# Altium schematic sheet baseboard.SchDoc
size A4
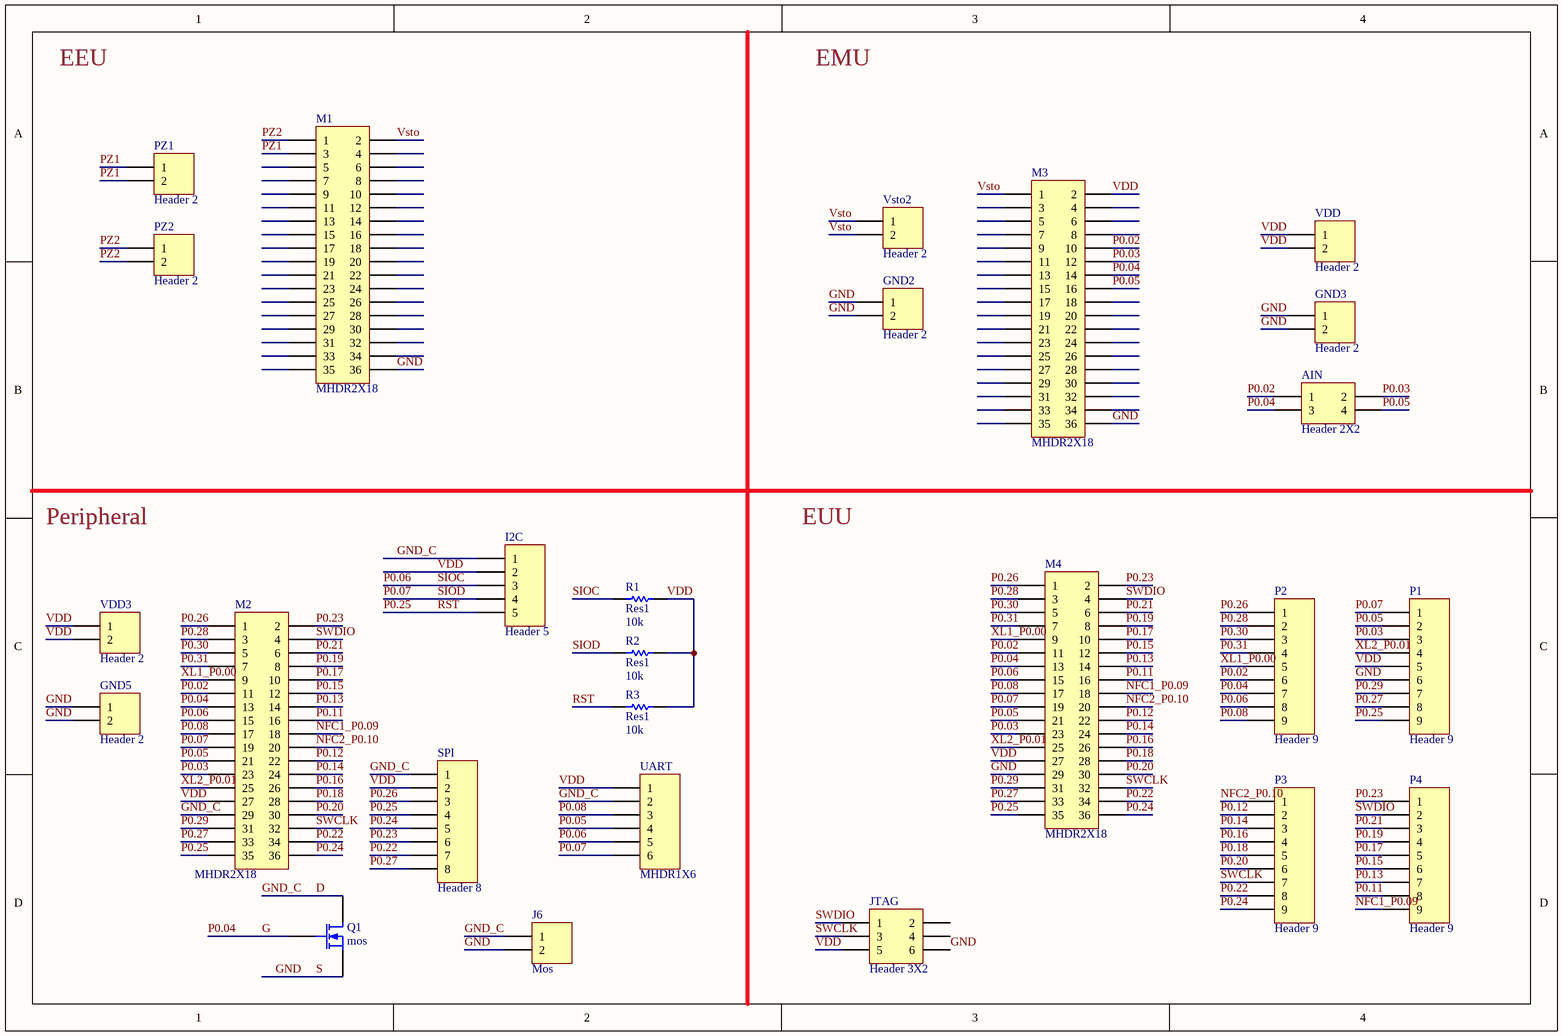
[diagram p0: baseboard.SchDoc]

## Parts
AIN  Header 2X2  [HDR2X2]
GND2  Header 2  [HDR1X2]
GND3  Header 2  [HDR1X2]
GND5  Header 2  [HDR1X2]
I2C  Header 5  [HDR1X5]
J6  Mos  [HDR1X2]
JTAG  Header 3X2  [HDR2X3]
M1  MHDR2X18  [module9x4]
M2  MHDR2X18  [module9x4]
M3  MHDR2X18  [module9x4]
M4  MHDR2X18  [module9x4]
P1  Header 9  [HDR1X9]
P2  Header 9  [HDR1X9]
P3  Header 9  [HDR1X9]
P4  Header 9  [HDR1X9]
PZ1  Header 2  [HDR1X2]
PZ2  Header 2  [HDR1X2]
Q1  mos  [SOT23_N]
R1  Res1  value 10k  [res]
R2  Res1  value 10k  [res]
R3  Res1  value 10k  [res]
SPI  Header 8  [HDR1X8]
UART  MHDR1X6  [HDR1X6]
VDD  Header 2  [HDR1X2]
VDD3  Header 2  [HDR1X2]
Vsto2  Header 2  [HDR1X2]

## Nets
D: I2C.1 J6.1 M2.29 Q1.1(D) SPI.1 UART.2  [also labelled GND_C]
G: AIN.3 M2.13 M3.14 M4.13 P2.7 Q1.3(G)  [also labelled P0.04]
GND: GND2.1 GND2.2 GND3.1 GND3.2 GND5.1 GND5.2 J6.2 JTAG.6 M1.36 M3.36 M4.29 P1.6 Q1.2(S)  [also labelled S]
NFC1_P0.09: M2.18 M4.18 P4.9
NFC2_P0.10: M2.20 M4.20 P3.1
P0.02: AIN.1 M2.11 M3.10 M4.11 P2.6
P0.03: AIN.2 M2.23 M3.12 M4.23 P1.3
P0.05: AIN.4 M2.21 M3.16 M4.21 P1.2 UART.4
P0.06: I2C.3 M2.15 M4.15 P2.8 R1.1 UART.5  [also labelled SIOC]
P0.07: I2C.4 M2.19 M4.19 P1.1 R2.1 UART.6  [also labelled SIOD]
P0.08: M2.17 M4.17 P2.9 UART.3
P0.11: M2.16 M4.16 P4.8
P0.12: M2.22 M4.22 P3.2
P0.13: M2.14 M4.14 P4.7
P0.14: M2.24 M4.24 P3.3
P0.15: M2.12 M4.12 P4.6
P0.16: M2.26 M4.26 P3.4
P0.17: M2.10 M4.10 P4.5
P0.18: M2.28 M4.28 P3.5
P0.19: M2.8 M4.8 P4.4
P0.20: M2.30 M4.30 P3.6
P0.21: M2.6 M4.6 P4.3
P0.22: M2.34 M4.34 P3.8 SPI.7
P0.23: M2.2 M4.2 P4.1 SPI.6
P0.24: M2.36 M4.36 P3.9 SPI.5
P0.25: I2C.5 M2.35 M4.35 P1.9 R3.1 SPI.4  [also labelled RST]
P0.26: M2.1 M4.1 P2.1 SPI.3
P0.27: M2.33 M4.33 P1.8 SPI.8
P0.28: M2.3 M4.3 P2.2
P0.29: M2.31 M4.31 P1.7
P0.30: M2.5 M4.5 P2.3
P0.31: M2.7 M4.7 P2.4
PZ1: M1.3 PZ1.1 PZ1.2
PZ2: M1.1 PZ2.1 PZ2.2
SWCLK: JTAG.3 M2.32 M4.32 P3.7
SWDIO: JTAG.1 M2.4 M4.4 P4.2
VDD: I2C.2 JTAG.5 M2.27 M3.2 M4.27 P1.5 R1.2 R2.2 R3.2 SPI.2 UART.1 VDD.1 VDD.2 VDD3.1 VDD3.2
Vsto: M1.2 M3.1 Vsto2.1 Vsto2.2
XL1_P0.00: M2.9 M4.9 P2.5
XL2_P0.01: M2.25 M4.25 P1.4

Not connected (* = marked no-connect by the designer): JTAG 2 4; M1 4 5 6 7 8 9 10 11 12 13 14 15 16 17 18 19 20 21 22 23 24 25 26 27 28 29 30 31 32 33 34 35; M3 3 4 5 6 7 8 9 11 13 15 17 18 19 20 21 22 23 24 25 26 27 28 29 30 31 32 33 34 35

## Notes on the sheet
- EEU
- EMU
- Peripheral
- EUU

## Library data of the parts
AIN = Header 2X2: Header, 2-Pin, Dual row; LatestRevisionDate: 17-Jul-2002; LatestRevisionNote: Re-released for DXP Platform.; Publisher: Altium Limited
GND2 GND3 GND5 J6 PZ1 PZ2 VDD VDD3 Vsto2 = Header 2: Header, 2-Pin; LatestRevisionDate: 17-Jul-2002; LatestRevisionNote: Re-released for DXP Platform.; Publisher: Altium Limited
I2C = Header 5: Header, 5-Pin; LatestRevisionDate: 17-Jul-2002; LatestRevisionNote: Re-released for DXP Platform.; Publisher: Altium Limited
JTAG = Header 3X2: Header, 3-Pin, Dual row; LatestRevisionDate: 17-Jul-2002; LatestRevisionNote: Re-released for DXP Platform.; Publisher: Altium Limited
M1-M4 = MHDR2X18: Header, 18-Pin, Dual row; LatestRevisionDate: 17-Jul-2002; LatestRevisionNote: Re-released for DXP Platform.; Publisher: Altium Limited
P1-P4 = Header 9: Header, 9-Pin; LatestRevisionDate: 17-Jul-2002; LatestRevisionNote: Re-released for DXP Platform.; Publisher: Altium Limited
Q1 = MOSFET-N: N-Channel MOSFET; Published: 8-Jun-2000; LatestRevisionDate: 17-Jul-2002; LatestRevisionNote: Re-released for DXP Platform.; PackageVersion: 1995/1996; PackageReference: E3; Publisher: Altium Limited; PackageDescription: TO, Flat Index; 3 In-Line, Axial Leads; Body Dia. 4.6mm; Lead Dia. 0.5 mm (max)
R1-R3 = Res1: Resistor; Published: 8-Jun-2000; LatestRevisionDate: 17-Jul-2002; LatestRevisionNote: Re-released for DXP Platform.; PackageReference: AXIAL-0.3; Publisher: Altium Limited; PackageDescription: Axial Device, Thru-Hole; 2 Leads; 0.3 in Pin Spacing
SPI = Header 8: Header, 8-Pin; LatestRevisionDate: 17-Jul-2002; LatestRevisionNote: Re-released for DXP Platform.; Publisher: Altium Limited
UART = MHDR1X6: Header, 6-Pin; LatestRevisionDate: 17-Jul-2002; LatestRevisionNote: Re-released for DXP Platform.; Publisher: Altium Limited